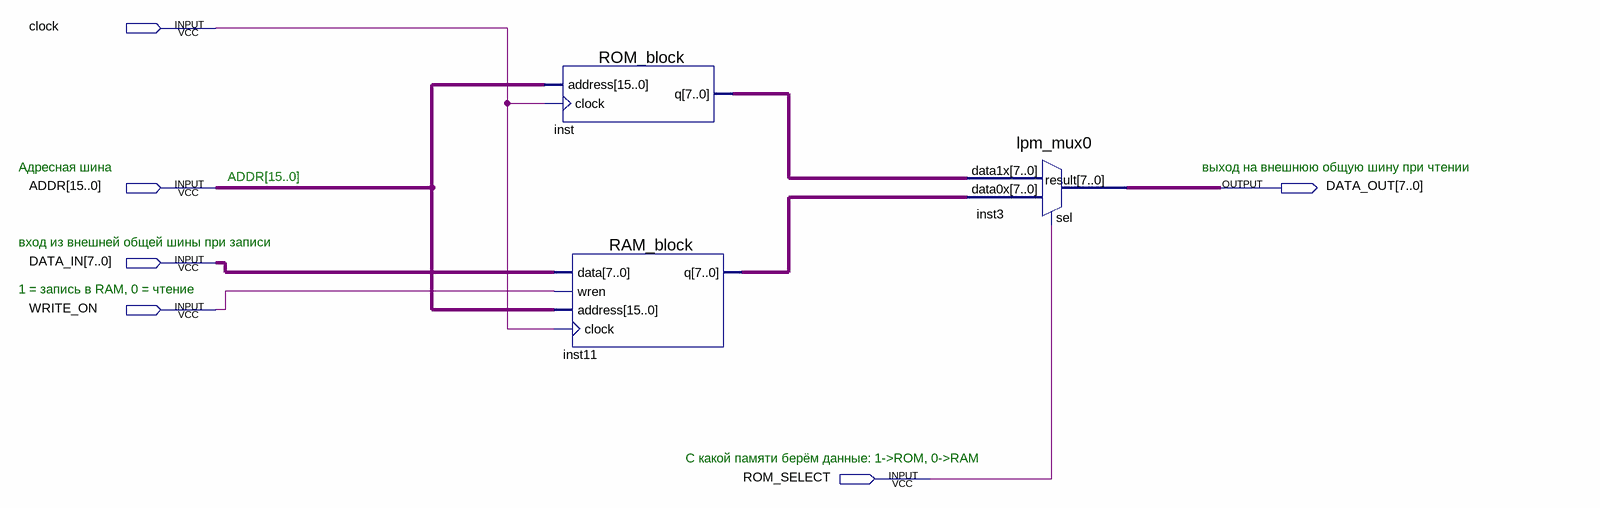
[diagram p0: schematic sheet]
// Quartus schematic memory.bdf as structural Verilog: 3 symbols, 6 pins
module memory (
  input  clock,
  input  [15:0] ADDR,
  input  [7:0] DATA_IN,
  input  WRITE_ON,
  input  ROM_SELECT,
  output [7:0] DATA_OUT
);

  wire [7:0] inst11_q, inst_q;

  ROM_block inst (.address(ADDR), .clock(clock), .q(inst_q));
  RAM_block inst11 (.data(DATA_IN), .wren(WRITE_ON), .address(ADDR), .clock(clock), .q(inst11_q));
  lpm_mux0 inst3 (.data1x(inst_q), .data0x(inst11_q), .sel(ROM_SELECT), .result(DATA_OUT));

  // Notes on the sheet:
  //   Адресная шина
  //   выход на внешнюю общую шину при чтении
  //   вход из внешней общей шины при записи
  //   1 = запись в RAM, 0 = чтение
  //   С какой памяти берём данные: 1->ROM, 0->RAM
endmodule
